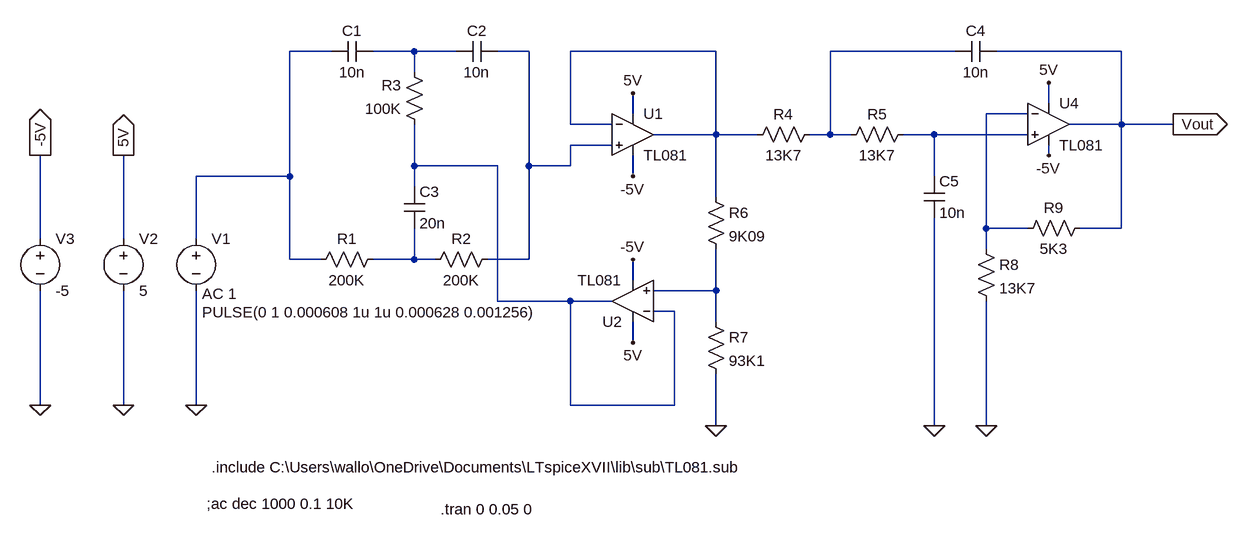
[diagram p0: schematic Draft1.asc]
Draft1.asc, the LTspice schematic file:
Version 4
SHEET 1 2420 860
WIRE 512 -336 448 -336
WIRE 640 -336 576 -336
WIRE 704 -336 640 -336
WIRE 816 -336 768 -336
WIRE 1104 -336 880 -336
WIRE 1472 -336 1280 -336
WIRE 1728 -336 1536 -336
WIRE 640 -304 640 -336
WIRE 1616 -256 1616 -288
WIRE 976 -240 976 -272
WIRE 1584 -240 1520 -240
WIRE 880 -224 880 -336
WIRE 944 -224 880 -224
WIRE 1728 -224 1728 -336
WIRE 1728 -224 1648 -224
WIRE 1808 -224 1728 -224
WIRE 1104 -208 1104 -336
WIRE 1104 -208 1008 -208
WIRE 1168 -208 1104 -208
WIRE 1280 -208 1280 -336
WIRE 1280 -208 1248 -208
WIRE 1312 -208 1280 -208
WIRE 1440 -208 1392 -208
WIRE 1584 -208 1440 -208
WIRE 944 -192 880 -192
WIRE 1616 -176 1616 -192
WIRE 640 -160 640 -224
WIRE 768 -160 640 -160
WIRE 816 -160 816 -336
WIRE 880 -160 880 -192
WIRE 880 -160 816 -160
WIRE 448 -144 448 -336
WIRE 448 -144 304 -144
WIRE 976 -144 976 -176
WIRE 1440 -144 1440 -208
WIRE 640 -128 640 -160
WIRE 1104 -112 1104 -208
WIRE 1520 -64 1520 -240
WIRE 1584 -64 1520 -64
WIRE 1728 -64 1728 -224
WIRE 1728 -64 1664 -64
WIRE 64 -48 64 -176
WIRE 192 -48 192 -176
WIRE 304 -48 304 -144
WIRE 1520 -32 1520 -64
WIRE 448 -16 448 -144
WIRE 496 -16 448 -16
WIRE 640 -16 640 -64
WIRE 640 -16 576 -16
WIRE 672 -16 640 -16
WIRE 816 -16 816 -160
WIRE 816 -16 752 -16
WIRE 976 16 976 -16
WIRE 1104 32 1104 -32
WIRE 1104 32 1008 32
WIRE 768 48 768 -160
WIRE 880 48 768 48
WIRE 944 48 880 48
WIRE 1040 64 1008 64
WIRE 1104 80 1104 32
WIRE 976 112 976 80
WIRE 64 208 64 32
WIRE 192 208 192 32
WIRE 304 208 304 32
WIRE 880 208 880 48
WIRE 1040 208 1040 64
WIRE 1040 208 880 208
WIRE 1104 240 1104 160
WIRE 1440 240 1440 -80
WIRE 1520 240 1520 48
FLAG 1104 240 0
FLAG 1440 240 0
FLAG 1520 240 0
FLAG 1808 -224 Vout
IOPIN 1808 -224 Out
FLAG 192 -176 5V
IOPIN 192 -176 Out
FLAG 304 208 0
FLAG 192 208 0
FLAG 1616 -288 5V
FLAG 976 -272 5V
FLAG 976 112 5V
FLAG 64 -176 -5V
IOPIN 64 -176 Out
FLAG 1616 -176 -5V
FLAG 976 -144 -5V
FLAG 976 -16 -5V
FLAG 64 208 0
SYMBOL cap 576 -352 R90
WINDOW 0 0 32 VBottom 2
WINDOW 3 32 32 VTop 2
SYMATTR InstName C1
SYMATTR Value 10n
SYMBOL res 592 -32 R90
WINDOW 0 0 56 VBottom 2
WINDOW 3 32 56 VTop 2
SYMATTR InstName R1
SYMATTR Value 200K
SYMBOL res 768 -32 R90
WINDOW 0 0 56 VBottom 2
WINDOW 3 32 56 VTop 2
SYMATTR InstName R2
SYMATTR Value 200K
SYMBOL res 656 -208 R180
WINDOW 0 36 76 Left 2
WINDOW 3 36 40 Left 2
SYMATTR InstName R3
SYMATTR Value 100K
SYMBOL cap 624 -128 R0
SYMATTR InstName C3
SYMATTR Value 20n
SYMBOL res 1264 -224 R90
WINDOW 0 0 56 VBottom 2
WINDOW 3 32 56 VTop 2
SYMATTR InstName R4
SYMATTR Value 13K7
SYMBOL res 1408 -224 R90
WINDOW 0 0 56 VBottom 2
WINDOW 3 32 56 VTop 2
SYMATTR InstName R5
SYMATTR Value 13K7
SYMBOL cap 1424 -144 R0
SYMATTR InstName C5
SYMATTR Value 10n
SYMBOL res 1088 -128 R0
SYMATTR InstName R6
SYMATTR Value 9K09
SYMBOL res 1088 64 R0
SYMATTR InstName R7
SYMATTR Value 93K1
SYMBOL res 1504 -48 R0
SYMATTR InstName R8
SYMATTR Value 13K7
SYMBOL res 1680 -80 R90
WINDOW 0 0 56 VBottom 2
WINDOW 3 32 56 VTop 2
SYMATTR InstName R9
SYMATTR Value 5K3
SYMBOL cap 1536 -352 R90
WINDOW 0 0 32 VBottom 2
WINDOW 3 32 32 VTop 2
SYMATTR InstName C4
SYMATTR Value 10n
SYMBOL cap 768 -352 R90
WINDOW 0 0 32 VBottom 2
WINDOW 3 32 32 VTop 2
SYMATTR InstName C2
SYMATTR Value 10n
SYMBOL OpAmps\\opamp2 1616 -288 R0
SYMATTR InstName U4
SYMATTR Value TL081
SYMBOL OpAmps\\opamp2 976 -272 R0
SYMATTR InstName U1
SYMATTR Value TL081
SYMBOL OpAmps\\opamp2 976 112 R180
SYMATTR InstName U2
SYMATTR Value TL081
SYMBOL voltage 304 -64 R0
WINDOW 123 9 101 Left 2
WINDOW 39 0 0 Left 0
WINDOW 3 9 129 Left 2
SYMATTR Value2 AC 1
SYMATTR Value PULSE(0 1 0.000608 1u 1u 0.000628 0.001256)
SYMATTR InstName V1
SYMBOL voltage 192 -64 R0
WINDOW 123 0 0 Left 0
WINDOW 39 0 0 Left 0
SYMATTR InstName V2
SYMATTR Value 5
SYMBOL voltage 64 -64 R0
WINDOW 123 0 0 Left 0
WINDOW 39 0 0 Left 0
SYMATTR InstName V3
SYMATTR Value -5
TEXT 328 304 Left 2 !.include C:\\Users\\wallo\\OneDrive\\Documents\\LTspiceXVII\\lib\\sub\\TL081.sub
TEXT 320 360 Left 2 !;ac dec 1000 0.1 10K
TEXT 680 368 Left 2 !.tran 0 0.05 0

The netlist it stands for:
* Draft1.asc
C1 N002 N001 10n
R1 N009 N001 200K
R2 N003 N009 200K
R3 N008 N002 100K
C3 N008 N009 20n
R4 N005 N004 13K7
R5 N007 N005 13K7
C5 N007 0 10n
R6 N004 N010 9K09
R7 N010 0 93K1
R8 N006 0 13K7
R9 Vout N006 5K3
C4 Vout N005 10n
C2 N003 N002 10n
XU4 N007 N006 5V -5V Vout TL081  ; pins In+ In- V+ V- OUT
XU1 N003 N004 5V -5V N004 TL081  ; pins In+ In- V+ V- OUT
XU2 N010 N008 5V -5V N008 TL081  ; pins In+ In- V+ V- OUT
V1 N001 0 PULSE(0 1 0.000608 1u 1u 0.000628 0.001256) AC 1
V2 5V 0 5
V3 -5V 0 -5
.include C:\Users\wallo\OneDrive\Documents\LTspiceXVII\lib\sub\TL081.sub
;ac dec 1000 0.1 10K
.tran 0 0.05 0
.backanno
.end